# EAGLE schematic Stage2_V2 (EAGLE 9.0.0)
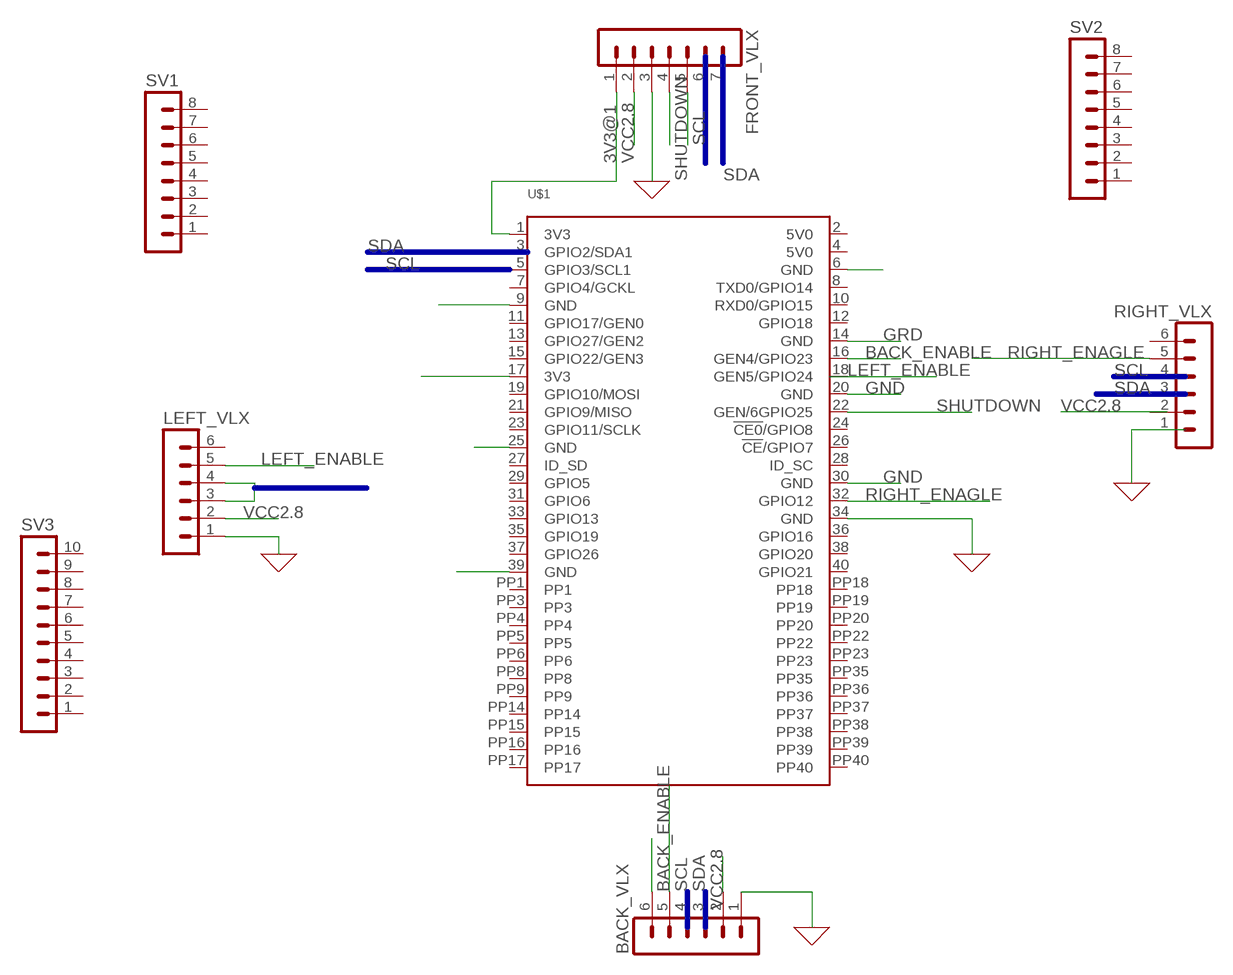
[diagram p0: schematic, sheet 1]

## Parts
BACK_VLX  MH_06X01A  [MH_06X01A]
FRONT_VLX  MH_07X01A  [MH_07X01A]
LEFT_VLX  MH_06X01A  [MH_06X01A]
RIGHT_VLX  MH_06X01A  [MH_06X01A]
SV1  MA08-1W  [MA08-1W]
SV2  MA08-1W  [MA08-1W]
SV3  MA10-1W  [MA10-1W]
U$1  RPI-ZERO  [RASP_PI_ZERO_BOARD_FULL]

## Nets
0: BACK_VLX.1 FRONT_VLX.3 LEFT_VLX.1 ; supply symbol labelled GND
3V3@1: FRONT_VLX.1 U$1.1(3V3)
3V3@2: U$1.17(3V3)
BACK_ENABLE: BACK_VLX.5 U$1.16(GEN4/GPIO23)
GND: U$1.20(GND) U$1.30(GND)
GND@1: U$1.9(GND)
GND@2: U$1.25(GND)
GND@3: U$1.39(GND)
GND@7: U$1.34(GND) ; supply symbol labelled GND
GND@8: U$1.6(GND)
GRD: U$1.14(GND)
LEFT_ENABLE: LEFT_VLX.5
N$4: FRONT_VLX.4
N$13: BACK_VLX.6
RIGHT_ENAGLE: RIGHT_VLX.5 U$1.32(GPIO12)
SCL: LEFT_VLX.4
SDA: LEFT_VLX.3
SHUTDOWN: FRONT_VLX.5 U$1.22(GEN/6GPIO25)
VCC2.8: BACK_VLX.2 FRONT_VLX.2 LEFT_VLX.2
Unconnected: BACK_VLX.3 BACK_VLX.4 FRONT_VLX.6 FRONT_VLX.7 LEFT_VLX.6 RIGHT_VLX.1 RIGHT_VLX.2 RIGHT_VLX.3 RIGHT_VLX.4 RIGHT_VLX.6 SV1.1 SV1.2 SV1.3 SV1.4 SV1.5 SV1.6 SV1.7 SV1.8 SV2.1 SV2.2 SV2.3 SV2.4 SV2.5 SV2.6 SV2.7 SV2.8 SV3.1 SV3.2 SV3.3 SV3.4 SV3.5 SV3.6 SV3.7 SV3.8 SV3.9 SV3.10 U$1.2(5V0) U$1.3(GPIO2/SDA1) U$1.4(5V0) U$1.5(GPIO3/SCL1) U$1.7(GPIO4/GCKL) U$1.8(TXD0/GPIO14) U$1.10(RXD0/GPIO15) U$1.11(GPIO17/GEN0) U$1.12(GPIO18) U$1.13(GPIO27/GEN2) U$1.15(GPIO22/GEN3) U$1.18(GEN5/GPIO24) U$1.19(GPIO10/MOSI) U$1.21(GPIO9/MISO) U$1.23(GPIO11/SCLK) U$1.24(!CE0!/GPIO8) U$1.26(!CE!/GPIO7) U$1.27(ID_SD) U$1.28(ID_SC) U$1.29(GPIO5) U$1.31(GPIO6) U$1.33(GPIO13) U$1.35(GPIO19) U$1.36(GPIO16) U$1.37(GPIO26) U$1.38(GPIO20) U$1.40(GPIO21) U$1.PP1 U$1.PP3 U$1.PP4 U$1.PP5 U$1.PP6 U$1.PP8 U$1.PP9 U$1.PP14 U$1.PP15 U$1.PP16 U$1.PP17 U$1.PP18 U$1.PP19 U$1.PP20 U$1.PP22 U$1.PP23 U$1.PP35 U$1.PP36 U$1.PP37 U$1.PP38 U$1.PP39 U$1.PP40

## Buses
SCL
SDA
I2C:SCL,SDA

## Library data of the parts
BACK_VLX LEFT_VLX RIGHT_VLX = Parts:MH_06X01A
FRONT_VLX = Parts:MH_07X01A
SV1 SV2 = con-lstb:MA08-1W: PIN HEADER; OC_FARNELL: unknown; OC_NEWARK: unknown
SV3 = con-lstb:MA10-1W: PIN HEADER; OC_FARNELL: unknown; OC_NEWARK: unknown
U$1 = Parts:RPI-ZERO: Raspberry Pi Zero Includes pogo pads. Borrowed, with graditude, from here <https://github.com/vitalibr/rpi-zero-eagle>.